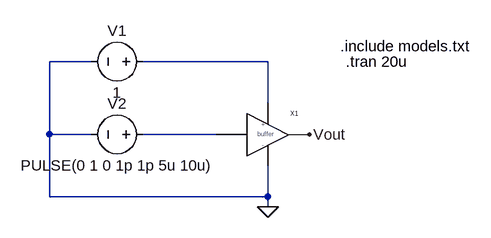
[diagram p0: schematic buffer_test.asc]
buffer_test.asc, the LTspice schematic file:
Version 4
SHEET 1 880 680
WIRE -32 64 -96 64
WIRE 240 64 48 64
WIRE 240 128 240 64
WIRE -96 176 -96 64
WIRE -32 176 -96 176
WIRE 160 176 48 176
WIRE -96 272 -96 176
WIRE 240 272 240 224
WIRE 240 272 -96 272
WIRE 240 288 240 272
FLAG 304 176 Vout
FLAG 240 288 0
SYMBOL buffer 240 176 R0
SYMATTR InstName X1
SYMBOL voltage 64 64 R90
WINDOW 0 -32 56 VBottom 2
WINDOW 3 32 56 VTop 2
WINDOW 123 0 0 Left 0
WINDOW 39 0 0 Left 0
SYMATTR InstName V1
SYMATTR Value 1
SYMBOL voltage 64 176 R90
WINDOW 0 -32 56 VBottom 2
WINDOW 3 32 56 VTop 2
WINDOW 123 0 0 Left 0
WINDOW 39 0 0 Left 0
SYMATTR InstName V2
SYMATTR Value PULSE(0 1 0 1p 1p 5u 10u)
TEXT 352 40 Left 2 !.include models.txt
TEXT 360 64 Left 2 !.tran 20u

The netlist it stands for:
* buffer_test.asc
XX1 N002 Vout N001 0 buffer  ; pins Vin Vout VHIGH VLOW
V1 N001 0 1
V2 N002 0 PULSE(0 1 0 1p 1p 5u 10u)
.include models.txt
.tran 20u
.backanno
.end